# EAGLE design jimney (EAGLE 6.4)
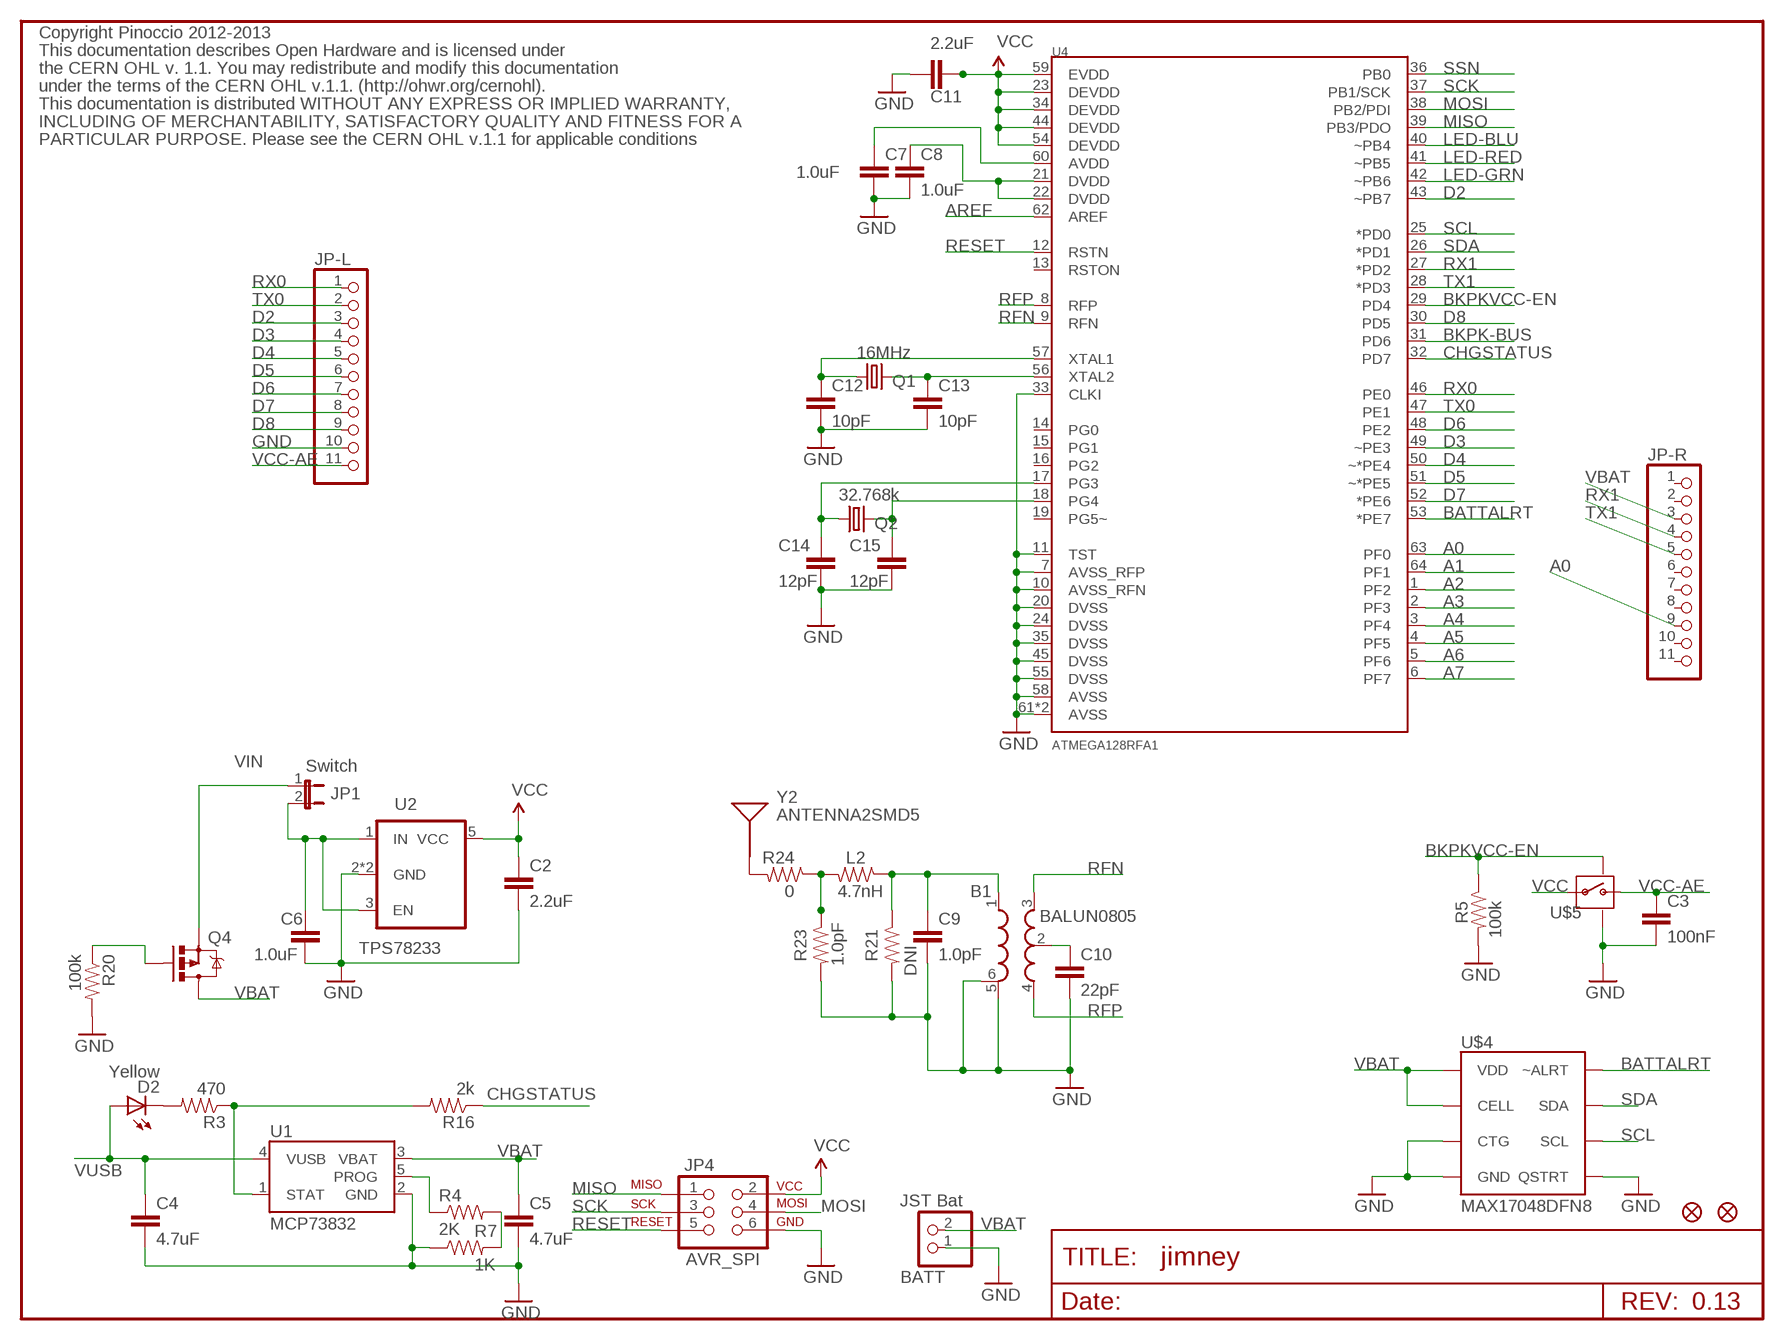
[diagram p0: schematic, sheet 1]

## Parts
B1  BALUN0805  [BALUN]
BATT  JST Bat  PINHD-1X2  [1X02]
C2  2.2uF  CAP0402-CAP  [0402-CAP]
C3  100nF  CAP0402-CAP  [0402-CAP]
C4  4.7uF  CAP0402-CAP  [0402-CAP]
C5  4.7uF  CAP0402-CAP  [0402-CAP]
C6  1.0uF  CAP0402-CAP  [0402-CAP]
C7  1.0uF  CAP0402-CAP  [0402-CAP]
C8  1.0uF  CAP0402-CAP  [0402-CAP]
C9  1.0pF  CAP0402-CAP  [0402-CAP]
C10  22pF  CAP0402-CAP  [0402-CAP]
C11  2.2uF  CAP0402-CAP  [0402-CAP]
C12  10pF  CAP0402-CAP  [0402-CAP]
C13  10pF  CAP0402-CAP  [0402-CAP]
C14  12pF  CAP0402-CAP  [0402-CAP]
C15  12pF  CAP0402-CAP  [0402-CAP]
D2  Yellow  LED0603  [LED-0603]
JP1  Switch  JUMPER-2PTH  [1X02]
JP3  FIDUCIAL1X2  [FIDUCIAL-1X2]
JP4  AVR_SPI  AVR_SPI_PRG_6  [2X3-PAD]
JP5  FIDUCIAL1X2  [FIDUCIAL-1X2]
JP-L  PINHD-1X11  [1X11]
JP-R  PINHD-1X11  [1X11]
L2  4.7nH  RESISTOR0402-RES  [0402-RES]
Q1  16MHz  CRYSTALABM10  [CRYSTAL-SMD-2.5X2-ABM10]
Q2  32.768k  CRYSTALABS06  [CRYSTAL-SMD-2X1.2-ABS06]
Q4  MOSFET-PCHANNELSMD  [SOT23-3]
R3  470  RESISTOR0402-RES  [0402-RES]
R4  2K  RESISTOR0402-RES  [0402-RES]
R5  100k  RESISTOR0402-RES  [0402-RES]
R7  1K  RESISTOR0402-RES  [0402-RES]
R16  2k  RESISTOR0402-RES  [0402-RES]
R20  100k  RESISTOR0402-RES  [0402-RES]
R21  DNI  RESISTOR0402-RES  [0402-RES]
R23  1.0pF  RESISTOR0402-RES  [0402-RES]
R24  0  RESISTOR0402-RES  [0402-RES]
U1  MCP73832  [SOT23-5]
U2  TPS78233  LDO-TPS78233  [SOT23-5]
U4  ATMEGA128RFA1  [QFN-64]
U$4  MAX17048DFN8  [DFN-8]
U$5  SWITCH-MOSFETTDFN4  [TDFN4]
Y2  ANTENNA2SMD5  [ANTENNA-CHIP5]

## Nets
A0: JP-R.9 U4.63(PF0)
A1: U4.64(PF1)
A2: U4.1(PF2)
A3: U4.2(PF3)
A4: U4.3(PF4)
A5: U4.4(PF5)
A6: U4.5(PF6)
A7: U4.6(PF7)
AREF: U4.62(AREF)
BATTALRT: U4.53(*PE7) U$4.P$5(~ALRT)
BKPK-BUS: U4.31(PD6)
BKPKVCC-EN: R5.1 U4.29(PD4) U$5.P$4(ON)
CHGSTATUS: R16.1 U4.32(PD7)
D2: U4.43(~PB7)
D3: U4.49(~PE3)
D4: U4.50(~*PE4)
D5: U4.51(~*PE5)
D6: U4.48(PE2)
D7: U4.52(*PE6)
D8: U4.30(PD5)
GND [GND]: B1.5(GND) B1.6(GND) BATT.1 C2.2 C3.2 C4.2 C5.2 C6.2 C7.2 C8.2 C9.2 C10.2 C11.2 C12.2 C13.2 C14.2 C15.2 JP4.6 R5.2 R7.1 R20.2 R21.2 R23.2 U1.2(GND) U2.2(GND) U2.4(GND) U4.7(AVSS_RFP) U4.10(AVSS_RFN) U4.11(TST) U4.20(DVSS) U4.24(DVSS) U4.33(CLKI) U4.35(DVSS) U4.45(DVSS) U4.55(DVSS) U4.58(AVSS) U4.61(AVSS) U4.PADDLE(AVSS) U$4.P$1(CTG) U$4.P$4(GND) U$4.P$6(QSTRT) U$4.P$9(GND) U$5.P$2(GND) U$5.P$5(GND)
LED-BLU: U4.40(~PB4)
LED-GRN: U4.42(~PB6)
LED-RED: U4.41(~PB5)
MISO: JP4.1 U4.39(PB3/PDO)
MOSI: JP4.4 U4.38(PB2/PDI)
N$4 [RF Antenna]: B1.1(IN) C9.1 L2.1 R21.1
N$8: R4.2 R7.2
N$10: C7.1 U4.60(AVDD)
N$11: R3.1 R16.2 U1.1(STAT)
N$13: B1.2(RFGND) C10.1
N$15: C12.1 Q1.P$1 U4.57(XTAL1)
N$16: C13.1 Q1.P$3 U4.56(XTAL2)
N$17: C14.1 Q2.P$1 U4.17(PG3)
N$18: C15.1 Q2.P$2 U4.18(PG4)
N$20: C8.1 U4.21(DVDD) U4.22(DVDD)
N$22: D2.C R3.2
N$27: L2.2 R23.1 R24.1
N$28: R24.2 Y2.FEED(SIGNAL)
N$51: JP1.1 Q4.2(S)
PROG: R4.1 U1.5(PROG)
RESET: JP4.5 U4.12(RSTN)
RFN: B1.3(OUT1) U4.9(RFN)
RFP: B1.4(OUT2) U4.8(RFP)
RX0: U4.46(PE0)
RX1: JP-R.4 U4.27(*PD2)
SCK: JP4.3 U4.37(PB1/SCK)
SCL: U4.25(*PD0) U$4.P$7(SCL)
SDA: U4.26(*PD1) U$4.P$8(SDA)
SSN: U4.36(PB0)
TX0: U4.47(PE1)
TX1: JP-R.5 U4.28(*PD3)
VBAT: BATT.2 C5.1 JP-R.3 Q4.3(D) U1.3(VBAT) U$4.P$2(CELL) U$4.P$3(VDD)
VCC [VCC]: C2.1 C11.1 JP4.2 U2.5(VCC) U4.23(DEVDD) U4.34(DEVDD) U4.44(DEVDD) U4.54(DEVDD) U4.59(EVDD) U$5.P$3(IN)
VCC-AE: C3.1 U$5.P$1(OUT)
VIN: C6.1 JP1.2 U2.1(IN) U2.3(EN)
VUSB: C4.1 D2.A Q4.1(G) R20.1 U1.4(VUSB)
Unconnected: JP-L.1 JP-L.2 JP-L.3 JP-L.4 JP-L.5 JP-L.6 JP-L.7 JP-L.8 JP-L.9 JP-L.10 JP-L.11 JP-R.1 JP-R.2 JP-R.6 JP-R.7 JP-R.8 JP-R.10 JP-R.11 U4.13(RSTON) U4.14(PG0) U4.15(PG1) U4.16(PG2) U4.19(PG5~)

## Notes on the sheet
- Copyright Pinoccio 2012-2013
- This documentation describes Open Hardware and is licensed under
- the CERN OHL v. 1.1. You may redistribute and modify this documentation
- under the terms of the CERN OHL v.1.1. (http://ohwr.org/cernohl).
- This documentation is distributed WITHOUT ANY EXPRESS OR IMPLIED WARRANTY,
- INCLUDING OF MERCHANTABILITY, SATISFACTORY QUALITY AND FITNESS FOR A
- PARTICULAR PURPOSE. Please see the CERN OHL v.1.1 for applicable conditions
- 0.13
- /Volumes/Data/Users/eric/Desktop/pinoccio.bmp
- /Volumes/Data/Users/eric/Desktop/pinoccio-1in.bmp | /Volumes/Data/Users/eric/Desktop/pinoccio-full-3-4in.bmp | /Volumes/Data/Users/eric/Desktop/pinoccio-full-3-4in.bmp

## Library data of the parts
B1 = Pinoccio:BALUN
BATT = pinhead:PINHD-1X2: PIN HEADER
C2-C15 = Pinoccio:CAP: Capacitor Standard 0603 ceramic capacitor, and 0.1" leaded capacitor.
D2 = Pinoccio:LED: LEDs Standard schematic elements and footprints for 5mm, 3mm, 1206, and 0603 sized LEDs. 5mm - Spark Fun Electronics SKU : COM-00529 (and others)
JP1 = Pinoccio:JUMPER-2: Jumper Basic 0.1" spaced jumper. Use with breakaway headers.
JP3 JP5 = Pinoccio:FIDUCIAL: Fiducial Alignment Points Various fiducial points for machine vision alignment.
JP4 = Pinoccio:AVR_SPI_PRG_6: AVR ISP 6 Pin This is the reduced ISP connector for AVR programming. Common on Arduino. This footprint will take up less PCB space and can be used with a 10-pin to 6-pin adapter such as SKU: BOB-08508
JP-L JP-R = pinhead:PINHD-1X11: PIN HEADER
L2 R3-R5 R7 R16 R20 R21 R23 R24 = Pinoccio:RESISTOR: Resistor Basic schematic elements and footprints for 0603, 1206, and PTH resistors.
Q1 Q2 = BeanLabs:CRYSTAL: Crystals Various standard crystals. Proven footprints. Spark Fun Electronics SKU : COM-00534
Q4 = Pinoccio:MOSFET-PCHANNEL
U1 = Pinoccio:MCP73832: Microchip's MCP73832 Miniature single cell, fully integrated Li-Ion, Li-polymer charge management controller http://ww1.microchip.com/downloads/en/DeviceDoc/21984a.pdf
U2 = Pinoccio:LDO-TPS78233: Voltage Regulator LDO 500nA Ground Current, 150mA, Ultra-Low Quiescent Current Low-Dropout Linear Regulator.
U4 = Pinoccio:ATMEGA128RFA1
U$4 = Pinoccio:MAX17048
U$5 = Pinoccio:SWITCH-MOSFET
Y2 = SparkFun:ANTENNA2: Antenna Single endded antenna. Common with smaller chip antennas. CHIP4 package is the GPS Chip Antenna SKU: GPS-08418. CHIP5 package is 2.4GHz chip antenna SKU: WRL-00144.

## Net classes
0 Default: width 0.203 mm
1 VCC: width 0.305 mm
2 LEDPower: width 0.203 mm
3 ButtonSignal: width 0.203 mm
4 RF Antenna: width 0.305 mm
5 GND: width 0.203 mm

## Board
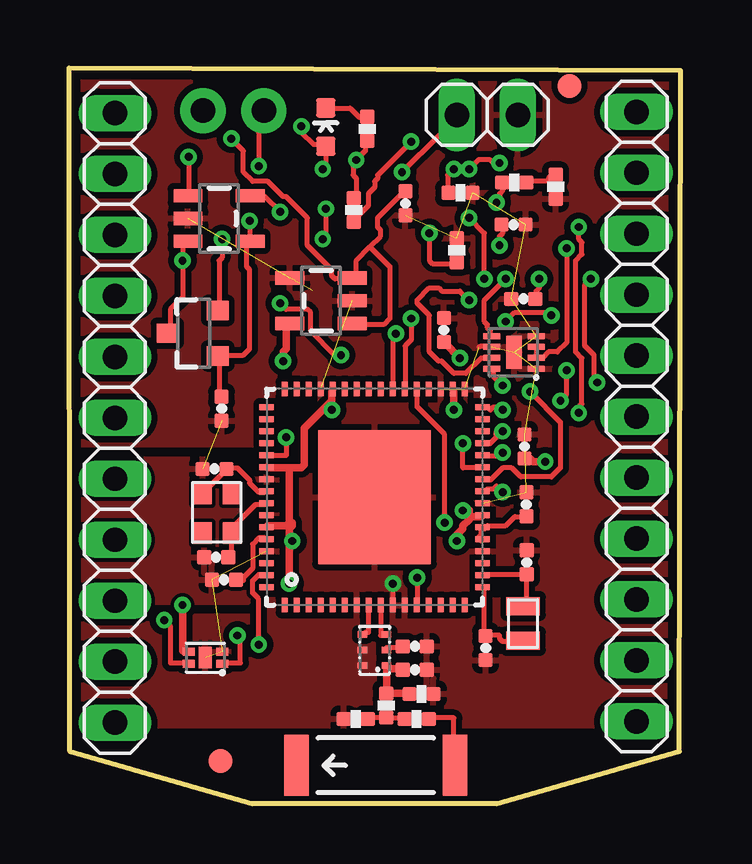
[diagram p1: board, top side]
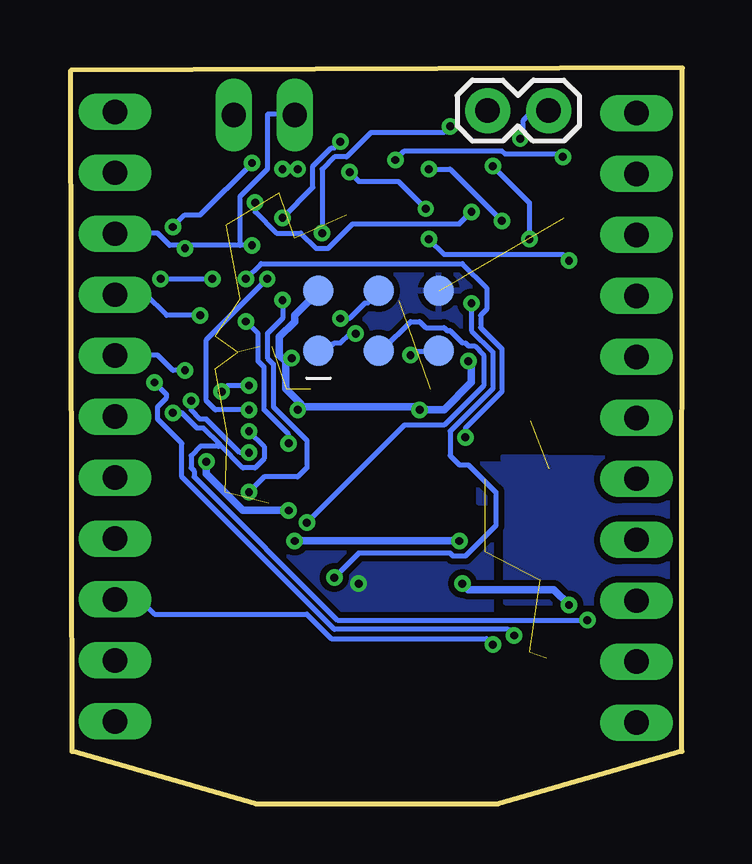
[diagram p2: board, bottom side, seen from below]

Size 25.48 x 30.66 mm. Coordinates in mm from the lower left corner, seen from the top.
Outline: 17.81,0 7.65,0 0.03,2.18 0,30.66 25.48,30.56 25.43,2.18 17.81,0
Copper layers (1*16): Top 0.0356mm / dielectric 1.5011mm / Bottom 0.0356mm
Design rules "default": minimum track width 6mil, minimum drill 13mil, track to track 6mil, track to pad 6mil, pad to pad 6mil, via to via 6mil, smd to smd 6mil, copper to edge 15mil, drill to drill 6mil, minimum pad ring 7mil, minimum via ring 7mil, stop-mask expansion 4mil, vias tented up to drill 16mil, thermal gap 10mil
tKeepout: area 12.5,5.9 to 13.4,6.3; area 11.6,6.5 to 12.2,6.9; area 13.1,6.6 to 13.7,6.9; area 11.5,6.2 to 12,6.5; area 11.5,5.9 to 12.4,6.2

### Footprints (pad centres in the part's own frame; a part is rotated, then mirrored left to right if it is on the bottom)
BALUN = smd 0.27 x 0.4: 1 -0.7,-0.5; 2 -0.05,-0.5; 3 0.6,-0.5; 4 0.6,0.5; 5 -0.05,0.5; 6 -0.7,0.5
1X02 = drill 1.016 long: 1 -1.27,0; 2 1.27,0
0402-CAP = smd 0.6 x 0.6: 1 -0.5,0; 2 0.5,0
LED-0603 = smd 0.8 x 0.8: A 0,-0.8; C 0,0.8
1X02' = drill 1.016 pad 1.88: 1 0,0; 2 2.54,0
FIDUCIAL-1X2 = smd 1 x 1: 1 0,0
2X3-PAD = smd 1.27 x 1.27: 1 0,0; 2 0,2.508; 3 2.508,0; 4 2.508,2.508; 5 5.016,0; 6 5.016,2.508
1X11 = drill 1.016 long: 1 -12.7,0; 2 -10.16,0; 3 -7.62,0; 4 -5.08,0; 5 -2.54,0; 6 0,0; 7 2.54,0; 8 5.08,0; 9 7.62,0; 10 10.16,0; 11 12.7,0
0402-RES = smd 0.6 x 0.6: 1 -0.5,0; 2 0.5,0
CRYSTAL-SMD-2.5X2-ABM10 = smd 0.9 x 0.8: P$1 -0.85,-0.65; P$2 0.8,-0.65; P$3 0.8,0.6; P$4 -0.85,0.6
CRYSTAL-SMD-2X1.2-ABS06 = smd 0.75 x 1.4: P$1 -0.725,0; P$2 0.725,0
SOT23-3 = smd 0.8 x 0.9: 1 -0.95,-1; 2 0.95,-1; 3 0,1.1
SOT23-5 = smd 0.55 x 1.2: 1 -0.95,-1.3; 2 0,-1.3; 3 0.95,-1.3; 4 0.95,1.3; 5 -0.95,1.3
QFN-64 = smd 0.6 x 0.25: 1 -4.5,3.75; 2 -4.5,3.25; 3 -4.5,2.75; 4 -4.5,2.25; 5 -4.5,1.75; 6 -4.5,1.25; 7 -4.5,0.75; 8 -4.5,0.25; 9 -4.5,-0.25; 10 -4.5,-0.75; 11 -4.5,-1.25; 12 -4.5,-1.75; 13 -4.5,-2.25; 14 -4.5,-2.75; 15 -4.5,-3.25; 16 -4.5,-3.75; 33 4.5,-3.75; 34 4.5,-3.25; 35 4.5,-2.75; 36 4.5,-2.25; 37 4.5,-1.75; 38 4.5,-1.25; 39 4.5,-0.75; 40 4.5,-0.25; 41 4.5,0.25; 42 4.5,0.75; 43 4.5,1.25; 44 4.5,1.75; 45 4.5,2.25; 46 4.5,2.75; 47 4.5,3.25; 48 4.5,3.75 | smd 0.25 x 0.6: 17 -3.75,-4.5; 18 -3.25,-4.5; 19 -2.75,-4.5; 20 -2.25,-4.5; 21 -1.75,-4.5; 22 -1.25,-4.5; 23 -0.75,-4.5; 24 -0.25,-4.5; 25 0.25,-4.5; 26 0.75,-4.5; 27 1.25,-4.5; 28 1.75,-4.5; 29 2.25,-4.5; 30 2.75,-4.5; 31 3.25,-4.5; 32 3.75,-4.5; 49 3.75,4.5; 50 3.25,4.5; 51 2.75,4.5; 52 2.25,4.5; 53 1.75,4.5; 54 1.25,4.5; 55 0.75,4.5; 56 0.25,4.5; 57 -0.25,4.5; 58 -0.75,4.5; 59 -1.25,4.5; 60 -1.75,4.5; 61 -2.25,4.5; 62 -2.75,4.5; 63 -3.25,4.5; 64 -3.75,4.5 | smd 5.588 x 4.699: PADDLE 0,0
DFN-8 = smd 0.25 x 0.7: P$1 0.125,0.35; P$2 0.575,0.35; P$3 1.025,0.35; P$4 1.475,0.35; P$5 1.475,2.2; P$6 1.025,2.2; P$7 0.575,2.2; P$8 0.125,2.2 | smd 1.37 x 0.64: P$9 0.8,1.275
TDFN4 = smd 0.325 x 0.5: P$1 0.35,0.1; P$2 0.85,0.1; P$3 0.85,1.5; P$4 0.35,1.5 | smd 0.9 x 0.55: P$5 0.6,0.8
ANTENNA-CHIP5 = smd 1.016 x 2.54: FEED -3.302,0; NC 3.302,0

### Placement (x,y rotation side)
B1  12.73,6.45 90 top
BATT  17.42,28.7 180 top
C2  15.62,19.74 90 top
C3  18.92,21.03 180 top
C4  6.35,16.46 270 top
C5  18.52,24.13 0 top
C6  14.01,25.02 270 top
C7  6.45,9.33 180 top
C8  19.05,12.47 90 top
C9  14.4,5.59 0 top
C10  14.4,6.55 0 top
C11  18.97,14.88 90 top
C12  6.13,10.27 180 top
C13  6.06,13.95 180 top
C14  17.35,6.49 270 top
C15  19.06,10.06 90 top
D2  10.69,28.19 0 top
JP1  Switch  [1X02']  8.12,28.88 0 bottom
JP3  20.85,29.9 0 top
JP4  15.16,18.87 0 bottom
JP5  6.3,1.78 0 top
JP-L  1.91,16.08 270 top
JP-R  23.65,16.13 270 top
L2  13.21,4.09 270 top
Q1  6.15,12.14 90 top
Q2  18.91,7.51 90 top
Q4  5.19,19.6 90 top
R3  12.42,28.12 90 top
R4  18.54,25.88 0 top
R5  16.31,25.45 0 top
R7  20.27,25.7 90 top
R16  11.86,24.74 90 top
R20  16.15,23.06 90 top
R21  14.68,4.57 0 top
R23  11.94,3.53 180 top
R24  14.48,3.53 0 top
U1  6.25,24.38 270 top
U2  10.5,20.96 90 top
U4  12.73,12.78 90 top
U$4  19.81,18.01 90 top
U$5  6.48,5.49 90 top
Y2  12.78,1.6 180 top

### Tracks (layer width: path | path; a pad name or v marks a point on that pad's centre or on a via)
A0  (via drill 0.33)
  Top 0.203: v7.9,6.63 7.9,8.53 7.65,8.79 7.65,9.3 7.9,9.55 8.15,9.55 U4.63
  Bottom 0.203: v7.9,6.63 8.15,6.88 14.63,6.88 15.65,7.9 22,7.9 22.63,8.53 23.65,8.53 JP-R.9
BATTALRT  (via drill 0.33)
  Top 0.203: v9.04,15.27 9.04,14.5 8.28,14.5 U4.53 | v18.19,21.87 17.3,20.98 17.3,20.09 17.42,19.96 17.42,19.84 17.55,19.71 17.55,19.58 U$4.P$5
  Bottom 0.203: v9.04,15.27 9.04,15.65 7.52,17.17 7.52,18.95 8.41,19.84 8.41,20.35 8.15,20.6 8.15,21.49 9.17,22.5 17.55,22.5 v18.19,21.87
BKPKVCC-EN  (via drill 0.33)
  Top 0.203: v16.03,26.44 15.77,26.19 15.77,25.55 R5.1 | v16.66,26.44 17.04,26.82 17.55,26.82 17.81,26.57 v17.93,26.7 | v21.23,24.03 21.23,23.52 21.36,23.39 21.36,22.89 21.11,22.63 21.11,18.82 21.36,18.57 21.36,16.66 21.23,16.54 v21.23,16.28 | v18.06,15.52 17.93,15.65 17.81,15.52 17.81,15.27 17.55,15.01 17.3,15.01 U4.29 | v3.96,7.65 4.22,7.39 4.22,5.87 4.85,5.87 U$5.P$4
  Bottom 0.203: v16.66,26.44 v16.03,26.44 | v17.93,26.7 20.09,24.54 20.73,24.54 v21.23,24.03 | v21.23,16.28 20.85,16.28 20.22,15.65 19.96,15.65 19.27,14.95 | 19.27,14.95 18.31,14 17.81,14 17.42,14.38 17.42,14.88 v18.06,15.52 | v3.96,7.65 14.38,7.65 20.35,13.61 20.35,13.87 20.47,14 20.47,14.5 20.09,14.88 19.33,14.88 19.27,14.95
CHGSTATUS  (via drill 0.33)
  Top 0.203: v14.25,27.58 12.85,26.19 12.85,26.06 12.73,25.93 12.73,25.68 12.47,25.43 12.47,24.92 11.96,24.41 11.96,24.28 R16.1 | v16.66,24.41 17.3,23.77 v17.3,21.87 | v18.06,16.41 17.93,16.54 17.68,16.54 17.55,16.41 17.42,16.54 17.3,16.54 U4.32
  Bottom 0.203: v14.25,27.58 14.5,27.33 14.63,27.33 15.39,26.57 15.39,25.68 v16.66,24.41 | v17.3,21.87 19.84,19.33 19.84,16.79 19.46,16.41 v18.06,16.41
GND  (via drill 0.33)  (22 unrouted)
  Top 0.203: U$4.P$6 17.55,19.08 17.17,19.08 17.08,19.03 | v13.49,9.17 13.49,8.28 U4.10
  pour Top (isolate 0.254): 25.48,30.63 25.43,8.39 17.45,8.36 17.2,8.36 8.23,8.33 8.38,14.94 0,14.94 0,30.66
  pour Bottom (isolate 0.254): 0.03,26.39 25.43,26.44 25.43,8.37 17.3,8.38 17.22,8.38 8.33,8.36 8.33,14.94 0.03,14.92
  pour Top (isolate 0.254, rank 2): -0.1,7.82 7.92,7.82 7.92,8.51 17.37,8.51 25.55,8.48 25.5,3.2 -0.18,3.23
  pour Top: -0.25,8.38 -0.18,14.38 7.47,14.38 7.47,14.1 8.43,14.1 8.38,12.5 7.47,12.52 7.44,8.38
  pour Bottom (isolate 0.254): -0.1,9.07 -0.1,12.32 -0.05,14.38 7.49,14.45 7.47,14.15 8.05,14.15 8.53,14.17 8.51,12.55 7.39,12.55 7.39,8.38 -0.18,8.38
  pour Bottom (isolate 0.254): -0.08,7.85 7.95,7.8 7.95,12.19 17.25,12.22 25.55,12.22 25.5,8.38 25.5,8.08 25.53,3.2 -0.13,3.2
  pour Top (rank 2, no thermals): 12.34,6.5 11,6.48 11.02,4.37 12.32,4.37 12.32,4.75
MISO  (via drill 0.33)
  Top 0.203: v13.61,19.58 13.49,19.46 13.49,17.3 U4.39
  Bottom 0.203: v13.61,19.58 13.87,19.58 14.25,19.2 14.5,19.2 14.88,18.82 15.14,18.82 JP4.1
MOSI  (via drill 0.33)
  Top 0.203: v14.25,20.22 14.25,19.33 14,19.08 14,17.3 U4.38
  Bottom 0.203: v14.25,20.22 13.87,20.22 13.23,20.85 13.11,20.85 12.6,21.36 JP4.4
N$4
  Top 0.305: 13.23,5.61 13.23,4.72 13.36,4.6 13.23,4.47 L2.1 13.49,4.6 14.12,4.6 R21.1 | 13.23,5.61 13.23,5.74 B1.1 | 13.23,5.61 13.87,5.61 C9.1
N$8
  Top 0.203: R4.2 19.08,25.93 19.96,25.93 19.96,26.06 20.22,26.31 R7.2
N$10
  Top 0.203: C7.1 7.01,9.3 7.26,9.3 7.26,9.42 7.65,9.8 7.65,10.82 7.9,11.07 8.15,11.07 U4.60
N$11  (via drill 0.33)
  Top 0.203: R16.2 11.96,25.3 11.96,26.06 11.84,26.19 11.84,26.57 11.96,26.7 v11.96,26.82 12.34,27.2 12.34,27.33 12.6,27.58 12.47,27.71 R3.1 | v4.98,26.95 4.98,25.43 U1.1
  Bottom 0.203: v4.98,26.95 5.11,27.08 7.39,27.08 7.52,27.2 11.58,27.2 v11.96,26.82
N$13
  Top 0.203: B1.2 13.23,6.5 13.87,6.5 C10.1
N$15
  Top 0.203: C12.1 6.63,10.31 6.76,10.31 6.76,11.2 Q1.P$1 6.76,11.33 6.76,11.46 7.77,12.47 8.15,12.47 U4.57
N$16
  Top 0.203: Q1.P$3 5.61,12.98 6.5,13.87 C13.1 6.63,14 7.01,14 7.52,13.49 7.52,13.36 7.9,12.98 8.15,12.98 U4.56
N$17
  Top 0.203: Q2.P$1 18.82,6.76 18.06,6.76 17.93,6.88 17.93,7.01 17.42,7.01 C14.1 17.3,6.88 17.17,7.01 17.3,7.14 17.3,8.92 U4.17
N$18
  Top 0.203: U4.18 17.3,9.55 18.95,9.55 C15.1 19.08,8.28 18.95,8.15 Q2.P$2
N$20
  Top 0.203: U4.21 17.17,10.95 17.04,11.07 17.17,11.2 17.17,11.46 U4.22 17.3,11.46 17.42,11.58 18.19,11.58 18.57,11.96 18.95,11.96 C8.1
N$22
  Top 0.203: R3.2 12.34,28.6 12.09,28.6 11.71,28.98 10.69,28.98 D2.C
N$27
  Top 0.203: R24.1 13.87,3.58 13.23,3.58 L2.2 13.11,3.58 12.47,3.58 R23.1
N$28
  Top 0.203: R24.2 15.01,3.58 16.03,3.58 16.03,1.68 Y2.FEED
N$51  (via drill 0.33)
  Top 0.203: v6.38,23.52 6.38,22.76 6.25,22.63 6.25,20.6 Q4.2 | v7.9,26.57 7.9,27.97 8.15,28.22 8.15,28.85 JP1.1
  Bottom 0.203: v6.38,23.52 6.38,25.04 v7.9,26.57
PROG  (via drill 0.33)
  Top 0.203: v8.79,24.66 8.15,25.3 7.65,25.3 U1.5 | v17.81,25.04 17.93,25.17 17.93,25.43 18.06,25.55 18.06,25.68 18.19,25.81 18.19,25.93 18.06,25.93 R4.1
  Bottom 0.203: v8.79,24.66 9.3,24.16 13.74,24.16 14.76,23.14 15.27,23.14 15.9,23.77 16.92,23.77 17.81,24.66 v17.81,25.04
RESET  (via drill 0.33)
  Top 0.203: v14.5,9.42 14.5,8.28 U4.12 | v8.79,20.85 9.04,20.6 9.93,20.6 10.06,20.47 10.06,19.71 11.07,18.69 v11.33,18.69
  Bottom 0.203: v14.5,9.42 13.49,10.44 9.68,10.44 9.55,10.31 9.04,10.31 7.77,11.58 7.77,12.98 8.92,14.12 9.3,14.12 9.68,14.5 9.68,15.52 7.9,17.3 7.9,18.82 8.79,19.71 v8.79,20.85 | v11.33,18.69 11.2,18.82 10.19,18.82 JP4.5
RFN
  Top 0.203: B1.3 13.11,7.01 12.98,7.01 12.98,8.15 U4.9
RFP
  Top 0.203: B1.4 12.34,7.14 12.47,7.14 12.47,8.15 U4.8
RX1  (via drill 0.33)
  Top 0.203: v20.09,20.35 19.96,20.47 18.57,20.47 v18.19,20.09 | v16.41,15.01 16.41,14 17.17,14 U4.27
  Bottom 0.203: v20.09,20.35 21.49,20.35 22.38,21.23 23.65,21.23 JP-R.4 | v18.19,20.09 17.68,19.58 17.68,18.44 17.42,18.19 17.42,16.41 16.41,15.39 v16.41,15.01
SCK  (via drill 0.33)
  Top 0.203: v15.65,11.71 15.65,15.39 14.5,16.54 14.5,17.17 U4.37
  Bottom 0.203: v15.65,11.71 11.58,15.77 9.93,15.77 8.28,17.42 8.28,18.69 8.66,19.08 8.92,19.08 9.04,19.2 9.17,19.2 9.68,19.71 9.8,19.71 9.93,19.84 10.69,19.84 10.95,20.09 11.33,20.09 12.47,18.95 12.47,18.82 12.6,18.82 JP4.3
SCL  (via drill 0.33)
  Top 0.203: v18.06,12.98 17.81,13.23 17.68,13.11 17.42,13.11 17.3,12.98 U4.25 | v16.66,20.98 16.28,21.36 15.52,21.36 15.39,21.49 15.01,21.49 14.5,20.98 14.5,20.85 15.01,20.35 15.01,18.82 15.39,18.44 15.52,18.44 16.03,17.93 16.54,17.93 17.17,18.57 17.55,18.57 U$4.P$7
  Bottom 0.203: v18.06,12.98 17.42,13.61 16.03,13.61 15.65,14 15.65,15.14 17.04,16.54 17.04,18.31 17.3,18.57 17.3,19.58 16.66,20.22 v16.66,20.98
SDA  (via drill 0.33)
  Top 0.203: v19.2,17.17 20.47,15.9 20.47,14 20.09,13.61 18.82,13.61 18.44,14 18.06,14 17.55,13.49 17.3,13.49 U4.26 | v18.06,17.42 17.68,17.81 17.68,18.06 U$4.P$8
  Bottom 0.203: v19.2,17.17 18.95,17.42 v18.06,17.42
TX1  (via drill 0.33)
  Top 0.203: v20.73,18.06 20.73,17.04 v20.47,16.79 | v18.06,14.63 17.93,14.5 17.3,14.5 U4.28
  Bottom 0.203: v20.73,18.06 21.23,18.06 21.87,18.69 23.65,18.69 JP-R.5 | v20.47,16.79 20.47,16.41 20.09,16.03 19.84,16.03 18.44,14.63 v18.06,14.63
VBAT  (via drill 0.33)
  Top 0.203: U$4.P$3 19.46,18.95 19.46,18.69 U$4.P$2 19.58,18.57 19.71,18.57 19.96,18.82 20.35,18.82 20.73,19.2 v20.73,23.14 | v17.93,23.27 17.93,23.65 18.06,23.77 18.06,23.9 18.19,24.03 18.19,24.16 18.06,24.16 C5.1 | Q4.3 4.22,19.71 4.22,20.6 4.72,21.11 v4.72,22.63 4.72,23.39 4.85,23.52 U1.3 | v10.57,23.52 10.69,23.65 v10.69,24.79 | v13.87,26.31 15.39,27.84 16.15,27.84 BATT.2
  Bottom 0.203: v17.93,23.27 18.44,23.27 | 18.44,23.27 20.73,23.27 | 20.73,23.27 21.36,23.27 21.87,23.77 23.65,23.77 JP-R.3 | 20.73,23.27 v20.73,23.14 | v4.72,22.63 4.98,22.89 9.93,22.89 v10.57,23.52 | v10.69,24.79 11.84,25.93 13.49,25.93 v13.87,26.31 | 18.44,23.27 18.44,25.3 17.3,26.44 17.3,28.73 16.15,28.73 BATT.2
VCC  (via drill 0.33)
  Top 0.305: 9.17,14 8.28,14 U4.54 | 9.17,11.71 9.17,14 | 9.17,11.71 9.04,11.58 8.28,11.58 U4.59 | v4.72,8.28 4.72,6.38 4.85,6.38 U$5.P$3 | 9.17,10.95 9.17,11.46 9.3,11.58 9.3,11.71 9.17,11.71 | 9.17,10.95 v9.17,9.17 | 10.76,16.6 9.8,15.65 9.8,14.12 9.68,14 9.17,14 | 10.76,16.6 10.95,16.79 10.95,17.17 U4.44 | 16.66,11.96 17.17,11.96 U4.23 | 16.66,11.96 16.66,11.84 16.41,11.58 16.41,11.46 16.15,11.2 v16.15,10.95 | v9.3,10.95 9.17,10.95 | v16.03,16.41 16.03,17.17 U4.34 | 10.76,16.6 v10.95,16.41 | v19.84,14.25 19.33,14.25 19.2,14.38 19.08,14.38 C11.1 | v16.41,12.22 16.66,12.22 16.66,11.96 | v16.28,18.57 15.65,19.2 C2.1 | v8.92,18.44 8.92,18.82 9.04,18.95 9.04,19.96 9.17,19.96 U2.5
  Bottom 0.305: v4.72,8.28 5.36,8.92 8.92,8.92 v9.17,9.17 | v9.3,10.95 v16.15,10.95 | v19.84,14.25 19.84,13.74 18.31,12.22 v16.41,12.22 | v8.92,18.44 8.79,18.31 8.79,17.55 9.93,16.41 v10.95,16.41 11.07,16.54 15.9,16.54 v16.03,16.41 15.9,16.66 16.54,17.3 16.54,18.31 v16.28,18.57 16.54,18.44 16.79,18.69 16.79,19.46 16.15,20.09 16.15,20.35 15.52,20.98 15.52,21.11 15.27,21.36 JP4.2
VCC-AE  (via drill 0.33)
  Top 0.203: v19.58,21.87 19.58,21.49 19.46,21.36 19.46,21.11 C3.1 | v21.74,21.87 21.49,21.62 21.49,19.08 21.87,18.69 21.87,17.68 v22,17.55 | v7.01,7.01 7.14,6.88 7.14,5.87 6.5,5.87 U$5.P$1
  Bottom 0.203: v21.74,21.87 v19.58,21.87 | v22,17.55 21.49,17.04 21.49,16.92 21.87,16.54 21.87,16.03 20.85,15.01 20.85,13.61 14.5,7.26 7.26,7.26 v7.01,7.01
VIN  (via drill 0.33)
  Top 0.203: v6.76,27.71 7.26,27.2 7.26,26.31 7.65,25.93 8.28,25.93 8.92,25.3 9.04,25.3 9.93,24.41 9.93,23.27 10.95,22.25 10.95,22 11.07,21.87 11.71,21.87 U2.3 11.84,21.87 11.96,21.87 11.96,22.63 12.53,23.2 | 12.53,23.2 12.98,23.65 12.98,23.9 12.85,24.03 12.85,24.41 13.87,25.43 13.87,25.55 14,25.55 C6.1 | 12.53,23.2 13.36,22.38 13.36,20.22 13.11,19.96 11.84,19.96 U2.1
  Bottom 0.203: v6.76,27.71 6.63,27.71 6.63,28.47 6.25,28.85 5.61,28.85 JP1.2
VUSB  (via drill 0.33)
  Top 0.203: C4.1 6.25,17.04 6.25,18.57 Q4.1 6.25,18.69 7.26,18.69 7.52,18.95 7.52,22.25 7.39,22.38 7.39,23.39 7.52,23.39 U1.4 7.52,23.52 v7.52,24.28 | v15.01,23.77 15.01,22.63 15.14,22.5 16.15,22.5 R20.1 | v9.68,28.22 9.68,27.97 10.19,27.46 10.69,27.46 D2.A 10.69,26.57 v10.57,26.44
  Bottom 0.203: v15.01,23.77 15.01,26.44 14.5,26.95 14,26.95 12.98,27.97 9.93,27.97 v9.68,28.22 | v7.52,24.28 9.68,26.44 v10.57,26.44

### Text on the board
tDocu: Jimney v0.01 (0.13) | Design by: linagee for Jimney | Licensed under CERN OHL v.1.1